# EAGLE design MCU (EAGLE 9.2.1)
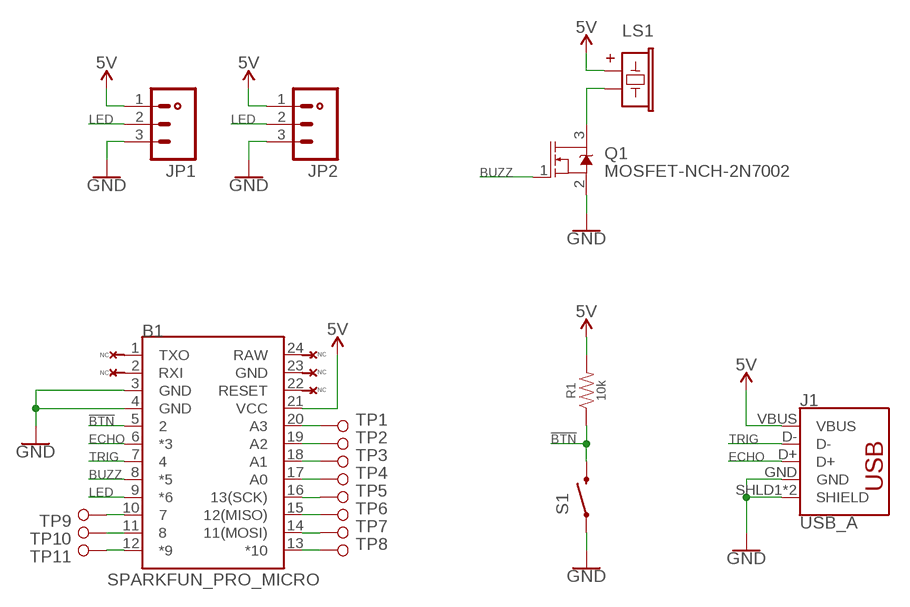
[diagram p0: schematic, sheet 1]

## Parts
B1  SPARKFUN_PRO_MICRO  [SPARKFUN_PRO_MICRO]
J1  USB_A  [USB-A-H]
JP1  M03PTH  [1X03]
JP2  M03PTH  [1X03]
LS1  BUZZER-PTH_KIT  [BUZZER-12MM-KIT]
Q1  MOSFET-NCH-2N7002  [SOT23-3]
R1  10k  RESISTOR0603  [0603]
S1  SWITCH-MOMENTARY-2SMD-REDUNDANT  [TACTILE-SWITCH-SMD]
TP1  TEST-POINT3X5  [PAD.03X.05]
TP2  TEST-POINT3X5  [PAD.03X.05]
TP3  TEST-POINT3X5  [PAD.03X.05]
TP4  TEST-POINT3X5  [PAD.03X.05]
TP5  TEST-POINT3X5  [PAD.03X.05]
TP6  TEST-POINT3X5  [PAD.03X.05]
TP7  TEST-POINT3X5  [PAD.03X.05]
TP8  TEST-POINT3X5  [PAD.03X.05]
TP9  TEST-POINT3X5  [PAD.03X.05]
TP10  TEST-POINT3X5  [PAD.03X.05]
TP11  TEST-POINT3X5  [PAD.03X.05]

## Nets
5V: B1.21(VCC) J1.VBUS JP1.1 JP2.1 LS1.+ R1.2
!BTN: B1.5 R1.1 S1.3 S1.4
BUZZ: B1.8(*5) Q1.1(G)
ECHO: B1.6(*3) J1.D+
GND: B1.3(GND) B1.4(GND) J1.GND J1.SHLD1(SHIELD) J1.SHLD2(SHIELD) JP1.3 JP2.3 Q1.2(S) S1.1 S1.2
LED: B1.9(*6) JP1.2 JP2.2
N$1: B1.16(13(SCK)) TP5.P$1
N$2: B1.15(12(MISO)) TP6.P$1
N$3: B1.14(11(MOSI)) TP7.P$1
N$4: LS1.- Q1.3(D)
N$5: B1.13(*10) TP8.P$1
N$6: B1.20(A3) TP1.P$1
N$7: B1.19(A2) TP2.P$1
N$8: B1.18(A1) TP3.P$1
N$9: B1.17(A0) TP4.P$1
N$10: B1.10 TP9.P$1
N$11: B1.11 TP10.P$1
N$12: B1.12(*9) TP11.P$1
TRIG: B1.7 J1.D-
Unconnected: B1.1(TXO) B1.2(RXI) B1.22(RESET)

## Power pins joined to a net without a drawn wire
GND: B1.23(GND)
RAW: B1.24(RAW)

## Library data of the parts
B1 = ParkingPal:SPARKFUN_PRO_MICRO: SparkFun Pro Micro Atmega32U4 compatible footprint. SparkFun Products: 3.3V/8MHz <https://www.sparkfun.com/products/12587> 5V/16MHz <https://www.sparkfun.com/products/12640>
J1 = ParkingPal:USB_A: USB-A Connector Male and female variants, as well as PTH and SMT variants SparkFun Products: SparkFun XBee Explorer Dongle <https://www.sparkfun.com/products/11697> PTH Male SparkFun MicroView-USB Programmer <https://www.sparkfun.com/products/12924> SMT Male SparkFun USB Type A Female Breakout <https://www.sparkfun.com/products/12700> SMT Female
JP1 JP2 = ParkingPal:M03: Header 3 Standard 3-pin 0.1" header. Use with straight break away headers (SKU : PRT-00116), right angle break away headers (PRT-00553), swiss pins (PRT-00743), machine pins (PRT-00117), and female headers (PRT-00115). Molex polarized connector foot print use with SKU : PRT-08232 with associated crimp pins and housings.
LS1 = ParkingPal:BUZZER: Buzzer Small round buzzers that operate around the audible 2kHz range. You can use these as speakers to create simple music or user interfaces. Variant Overview: PTH - Mini Speaker - PC Mount 12mm 2.048kHz <https://www.sparkfun.com/products/7950> PTH_KIT - Mini Speaker - PC Mount 12mm 2.048kHz <https://www.sparkfun.com/products/7950> KIT simplifies soldering by adding stop mask to one side of the pads. PTH_NO_SILK - Mini Speaker - PC Mount 12mm 2.048kHz <https://www.sparkfun.com/products/7950> No silkscreen indicator of buzzer outline. PTH_KIT_NO_SILK - Mini Speaker - PC Mount 12mm 2.048kHz <https://www.sparkfun.com/products/7950> KIT package w/o silkscreen SMD - Buzzer Audio Magnetic (CCV-084B16) SMD buzzer used on, e.g. the LilyPad Buzzer <https://www.sparkfun.com/products/8463> and RFID USB Reader <https://www.sparkfun.com/products/9963>. SMD_KIT - Buzzer Audio Magnetic (CCV-084B16) SMD Buzzer with elongated pins to make soldering easier. Used on the SparkFun Simon Says - Surface Mount Soldering Kit <https://www.sparkfun.com/products/10935>.; PROD_ID: COMP-08253; SF_SKU: COM-07950
Q1 = ParkingPal:MOSFET-NCH: N-channel MOSFETs Voltage controlled devices that allow control of high current outputs. SparkFun Products: SparkFun OpenScale <https://www.sparkfun.com/products/13261> SparkFun Digital Sandbox <https://www.sparkfun.com/products/12651> SparkFun Monster Moto Shield <https://www.sparkfun.com/products/10182> SparkFun MOSFET Power Controller <https://www.sparkfun.com/products/11214>
R1 = ParkingPal:RESISTOR: Generic Resistor Package
S1 = ParkingPal:SWITCH-MOMENTARY-2: Various NO switches- pushbuttons, reed, etc; PROD_ID: SWCH-08247
TP1-TP11 = ParkingPal:TEST-POINT: SparkFun Test Points Bare copper test points for troubleshooting or In-Circuit-Testing. These are used by our Production team for verifying production board runs using pogo-pins on test beds. SparkFun Products: SparkFun LSM9DS1 Breakout <https://www.sparkfun.com/products/13284> SparkFun PSOC <https://www.sparkfun.com/products/13714> SparkFun Load Cell Amplifier <https://www.sparkfun.com/products/13879>

## Board
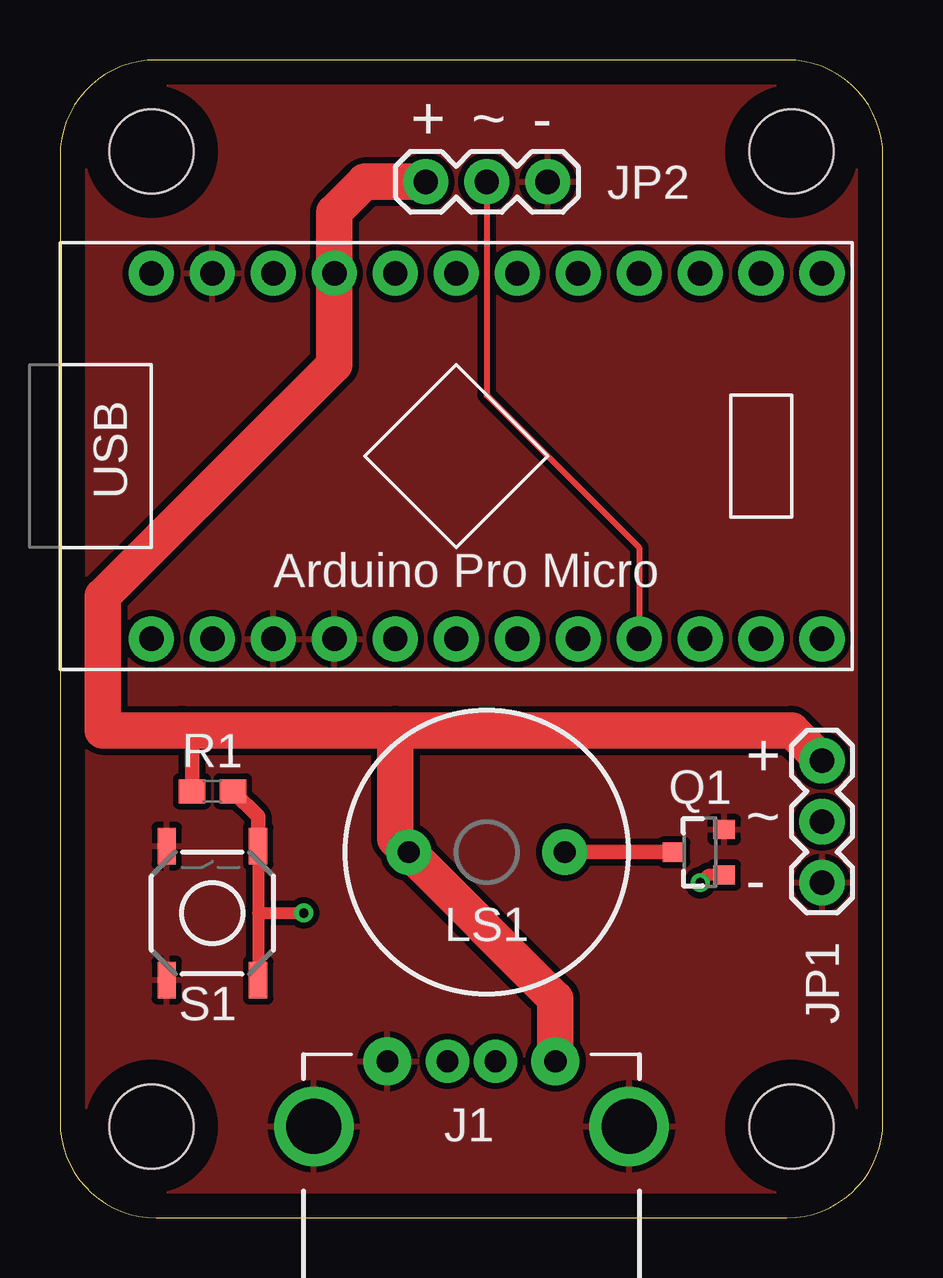
[diagram p1: board, top side]
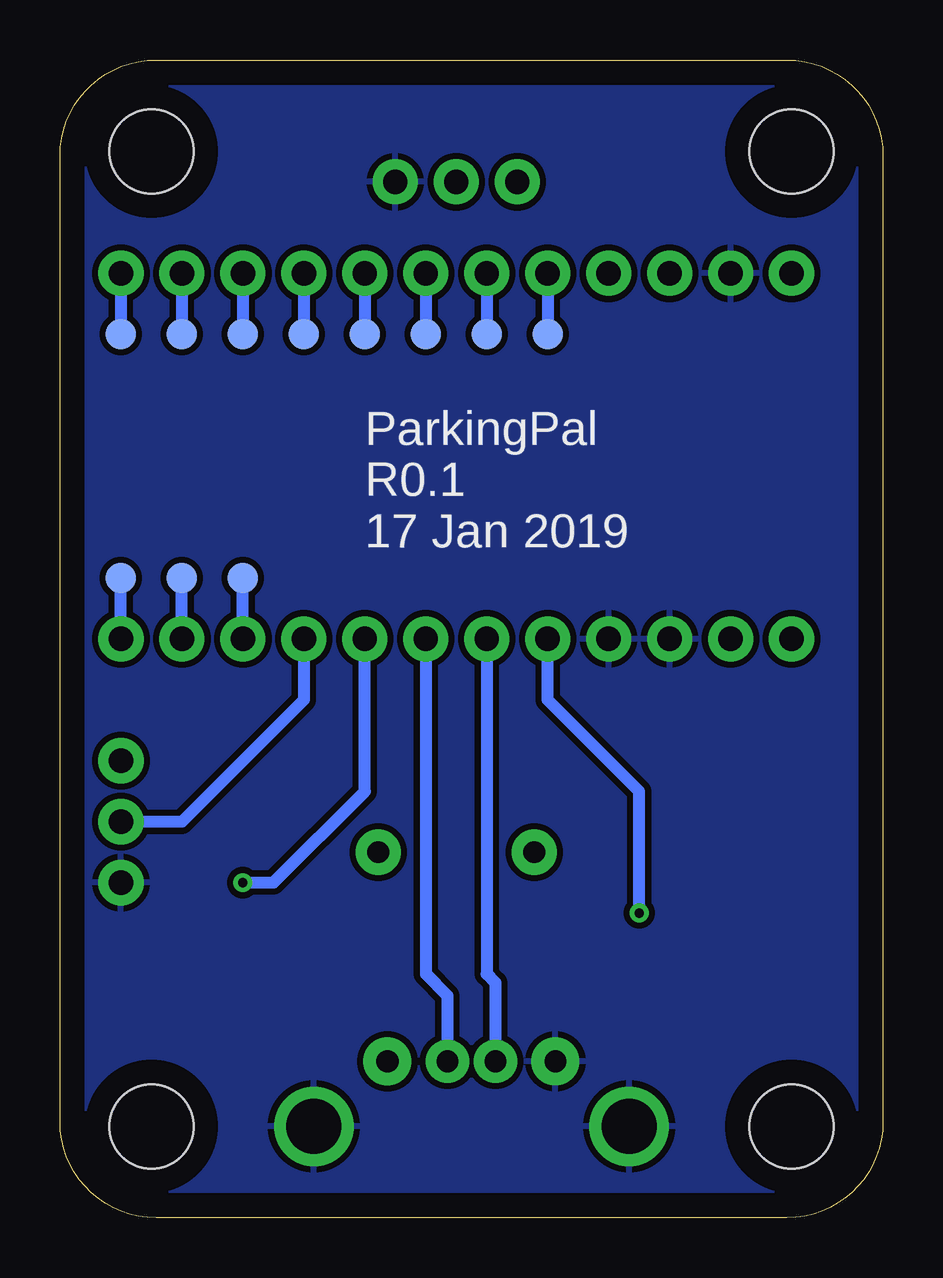
[diagram p2: board, bottom side, seen from below]

Size 34.29 x 48.26 mm. Coordinates in mm from the lower left corner, seen from the top.
Outline: 0,44.26 0,4 arc90 4,0 30.29,0 arc90 34.29,4 34.29,44.26 arc90 30.29,48.26 4,48.26 arc90 0,44.26
Copper layers (1*16): Top 0.035mm / dielectric 1.5mm / Bottom 0.035mm
Design rules "default *": minimum track width 6mil, minimum drill 0.35mm, track to track 6mil, track to pad 6mil, pad to pad 6mil, via to via 6mil, smd to smd 6mil, copper to edge 40mil, drill to drill 6mil, minimum pad ring 10mil, minimum via ring 8mil, stop-mask expansion 4mil, vias tented up to drill 25mil, thermal gap 10mil
Holes 3.5 mm at 3.81,3.81 30.48,3.81 3.81,44.45 30.48,44.45

### Footprints (pad centres in the part's own frame; a part is rotated, then mirrored left to right if it is on the bottom)
SPARKFUN_PRO_MICRO = drill 1.016 pad 1.88: 1 -7.62,12.7; 2 -7.62,10.16; 3 -7.62,7.62; 4 -7.62,5.08; 5 -7.62,2.54; 6 -7.62,0; 7 -7.62,-2.54; 8 -7.62,-5.08; 9 -7.62,-7.62; 10 -7.62,-10.16; 11 -7.62,-12.7; 12 -7.62,-15.24; 13 7.62,-15.24; 14 7.62,-12.7; 15 7.62,-10.16; 16 7.62,-7.62; 17 7.62,-5.08; 18 7.62,-2.54; 19 7.62,0; 20 7.62,2.54; 21 7.62,5.08; 22 7.62,7.62; 23 7.62,10.16; 24 7.62,12.7
USB-A-H = drill 0.914 pad 1.8: D+ 2.71,1; D- 2.71,-1 | drill 0.914 pad 2: GND 2.71,3.5 | drill 2.3: SHLD1 0,-6.57; SHLD2 0,6.57 | drill 0.92 pad 2: VBUS 2.71,-3.5
1X03 = drill 1.016 pad 1.88: 1 0,0; 2 2.54,0; 3 5.08,0
BUZZER-12MM-KIT = drill 0.9 pad 1.88: + 3.25,0; - -3.25,0
SOT23-3 = smd 0.8 x 0.9: 1 -0.95,-1; 2 0.95,-1; 3 0,1.1
0603 = smd 1.1 x 1: 1 -0.85,0; 2 0.85,0
TACTILE-SWITCH-SMD = smd 1.524 x 0.762: 1 -2.794,1.905; 2 2.794,1.905; 3 -2.794,-1.905; 4 2.794,-1.905
PAD.03X.05 = smd 1.27 x 1.27: P$1 0,0

### Placement (x,y rotation side)
B1  16.51,31.75 90 top
J1  17.14,3.81 90 top
JP1  31.75,19.05 270 top
JP2  15.24,43.18 0 top
LS1  17.78,15.24 180 top
Q1  26.67,15.24 90 top
R1  6.35,17.78 180 top
S1  6.35,12.7 90 top
TP1  13.97,36.83 180 bottom
TP2  16.51,36.83 0 bottom
TP3  19.05,36.83 0 bottom
TP4  21.59,36.83 0 bottom
TP5  24.13,36.83 0 bottom
TP6  26.67,36.83 0 bottom
TP7  29.21,36.83 0 bottom
TP8  31.75,36.83 0 bottom
TP9  26.67,26.67 0 bottom
TP10  29.21,26.67 0 bottom
TP11  31.75,26.67 0 bottom

### Tracks (layer width: path | path; a pad name or v marks a point on that pad's centre or on a via)
5V
  Top 0.61: R1.2 5.5,19.9 5.08,20.32
  Top 1.524: JP1.1 30.48,20.32 13.97,20.32 | 13.97,20.32 5.08,20.32 1.78,20.32 1.78,25.91 11.43,35.56 B1.21 11.43,41.91 12.7,43.18 JP2.1 | 13.97,20.32 13.97,15.8 LS1.+ 20.64,9.12 J1.VBUS
!BTN  (via drill 0.38)
  Top 0.508: S1.4 8.26,12.7 | 8.26,12.7 S1.3 | 8.26,12.7 v10.16,12.7
  Top 0.61: R1.1 8.26,16.73 S1.4
  Bottom 0.508: B1.5 13.97,21.59 10.16,17.78 v10.16,12.7
BUZZ  (via drill 0.38)
  Top 0.508: Q1.1 26.99,14.29 v26.67,13.97
  Bottom 0.508: B1.8 21.59,17.78 25.4,13.97 v26.67,13.97
ECHO
  Bottom 0.508: B1.6 16.51,10.16 16.14,9.79 J1.D+
GND
  pour Top (isolate 0.254): -1.27,49.53 35.56,49.53 35.56,-1.27 -1.27,-1.27
  pour Bottom (isolate 0.254): 35.56,49.53 -1.27,49.53 -1.27,-1.27 35.56,-1.27
LED
  Top 0.254: JP2.2 17.78,34.29 24.13,27.94 B1.9
  Bottom 0.508: B1.9 24.13,21.59 29.21,16.51 JP1.2
N$1
  Bottom 0.508: B1.16 TP5.P$1
N$2
  Bottom 0.508: B1.15 TP6.P$1
N$3
  Bottom 0.508: B1.14 TP7.P$1
N$4
  Top 0.61: LS1.- Q1.3
N$5
  Bottom 0.508: B1.13 TP8.P$1
N$6
  Bottom 0.508: B1.20 TP1.P$1
N$7
  Bottom 0.508: B1.19 TP2.P$1
N$8
  Bottom 0.508: B1.18 TP3.P$1
N$9
  Bottom 0.508: B1.17 TP4.P$1
N$10
  Bottom 0.508: B1.10 TP9.P$1
N$11
  Bottom 0.508: B1.11 TP10.P$1
N$12
  Bottom 0.508: B1.12 TP11.P$1
TRIG
  Bottom 0.508: B1.7 19.05,10.16 18.14,9.26 J1.D-

### Text on the board
tPlace: + | ~ | - | USB | Arduino Pro Micro | + | ~ | -
bPlace: ParkingPal / R0.1 / 17 Jan 2019